# EAGLE design LEDBreakOutBoard (EAGLE 8.3.1)
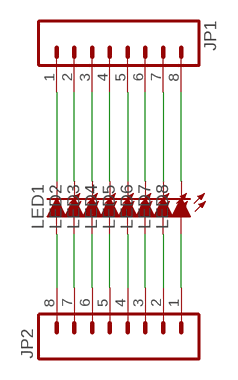
[diagram p0: schematic, sheet 1]

## Parts
JP1  M08  [1X08]
JP2  M08  [1X08]
LED1  LED-0805  [LED-805]
LED2  LED-0805  [LED-805]
LED3  LED-0805  [LED-805]
LED4  LED-0805  [LED-805]
LED5  LED-0805  [LED-805]
LED6  LED-0805  [LED-805]
LED7  LED-0805  [LED-805]
LED8  LED-0805  [LED-805]

## Nets
N$1: JP1.1 LED1.C
N$2: JP2.8 LED1.A
N$3: JP2.7 LED2.A
N$4: JP1.2 LED2.C
N$5: JP2.6 LED3.A
N$6: JP1.3 LED3.C
N$7: JP2.5 LED4.A
N$8: JP1.4 LED4.C
N$9: JP1.5 LED5.C
N$10: JP2.4 LED5.A
N$11: JP2.3 LED6.A
N$12: JP1.6 LED6.C
N$13: JP1.7 LED7.C
N$14: JP2.2 LED7.A
N$15: JP2.1 LED8.A
N$16: JP1.8 LED8.C

## Library data of the parts
JP1 JP2 = HyTechDevices:M08: Standard 8-pin 0.1" header. NOTES ON THE VARIANTS LOCK and LOCK_LONGPADS... This footprint was designed to help hold the alignment of a through-hole component (i.e. 6-pin header) while soldering it into place. You may notice that each hole has been shifted either up or down by 0.005 of an inch from it's more standard position (which is a perfectly straight line). This slight alteration caused the pins (the squares in the middle) to touch the edges of the holes. Because they are alternating, it causes a "brace" to hold the component in place. 0.005 has proven to be the perfect amount of "off-center" position when using our standard breakaway headers. Although looks a little odd when you look at the bare footprint, once you have a header in there, the alteration is very hard to notice. Also,if you push a header all the way into place, it is covered up entirely on the bottom side. This idea of altering the position of holes to aid alignment will be further integrated into the Sparkfun Library for other footprints. It can help hold any component with 3 or more connection pins. Note: The Sparkfun version includes many other packages including surface mount that may be of future interest. Source: Sparkfun <https://github.com/sparkfun/SparkFun-Eagle-Libraries>
LED1-LED8 = HyTechDevices:LED: Light Emitting Diode (LED) Source: Dangerous Prototypes Eagle Library <https://github.com/DangerousPrototypes/Eagle_Part_Library>

## Board
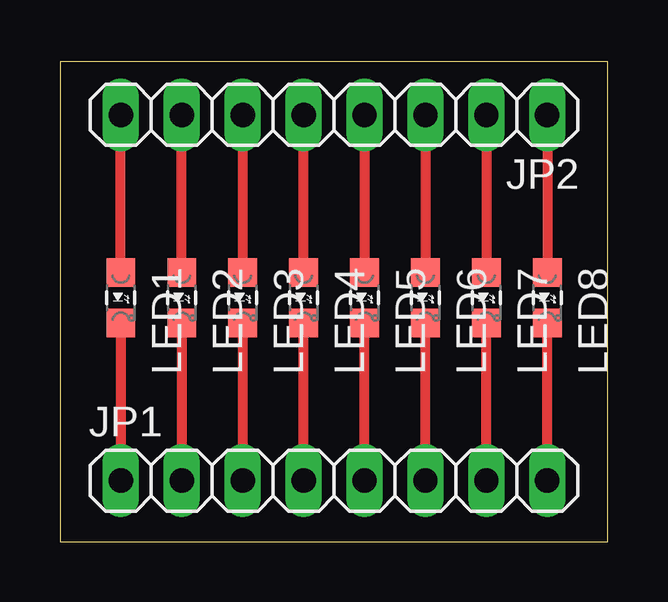
[diagram p1: board, top side]

Size 22.84 x 19.99 mm. Coordinates in mm from the lower left corner, seen from the top.
Outline: 0,0 22.84,0 22.84,19.99 0,19.99 0,0
Copper layers (1*16): Top 0.035mm / dielectric 1.5mm / Bottom 0.035mm
Design rules "default": minimum track width 6mil, minimum drill 0.35mm, track to track 6mil, track to pad 6mil, pad to pad 6mil, via to via 6mil, smd to smd 6mil, copper to edge 40mil, drill to drill 6mil, minimum pad ring 10mil, minimum via ring 8mil, stop-mask expansion 4mil, vias tented up to drill 0mil, thermal gap 10mil

### Footprints (pad centres in the part's own frame; a part is rotated, then mirrored left to right if it is on the bottom)
1X08 = drill 1.016 long: 1 -8.89,0; 2 -6.35,0; 3 -3.81,0; 4 -1.27,0; 5 1.27,0; 6 3.81,0; 7 6.35,0; 8 8.89,0
LED-805 = smd 1.2 x 1.2: A 0,-1.05; C 0,1.05

### Placement (x,y rotation side)
JP1  11.43,2.54 0 top
JP2  11.43,17.78 180 top
LED1  2.54,10.16 180 top
LED2  5.08,10.16 180 top
LED3  7.62,10.16 180 top
LED4  10.16,10.16 180 top
LED5  12.7,10.16 180 top
LED6  15.24,10.16 180 top
LED7  17.78,10.16 180 top
LED8  20.32,10.16 180 top

### Tracks (layer width: path | path; a pad name or v marks a point on that pad's centre or on a via)
N$1
  Top 0.406: LED1.C JP1.1
N$2
  Top 0.406: LED1.A JP2.8
N$3
  Top 0.406: LED2.A JP2.7
N$4
  Top 0.406: LED2.C JP1.2
N$5
  Top 0.406: JP2.6 LED3.A
N$6
  Top 0.406: LED3.C JP1.3
N$7
  Top 0.406: LED4.A JP2.5
N$8
  Top 0.406: JP1.4 LED4.C
N$9
  Top 0.406: JP1.5 LED5.C
N$10
  Top 0.406: JP2.4 LED5.A
N$11
  Top 0.406: JP2.3 LED6.A
N$12
  Top 0.406: JP1.6 LED6.C
N$13
  Top 0.406: JP1.7 LED7.C
N$14
  Top 0.406: JP2.2 LED7.A
N$15
  Top 0.406: JP2.1 LED8.A
N$16
  Top 0.406: JP1.8 LED8.C